# EAGLE design mosfet+buck_inverterV2 (EAGLE 9.3.0)
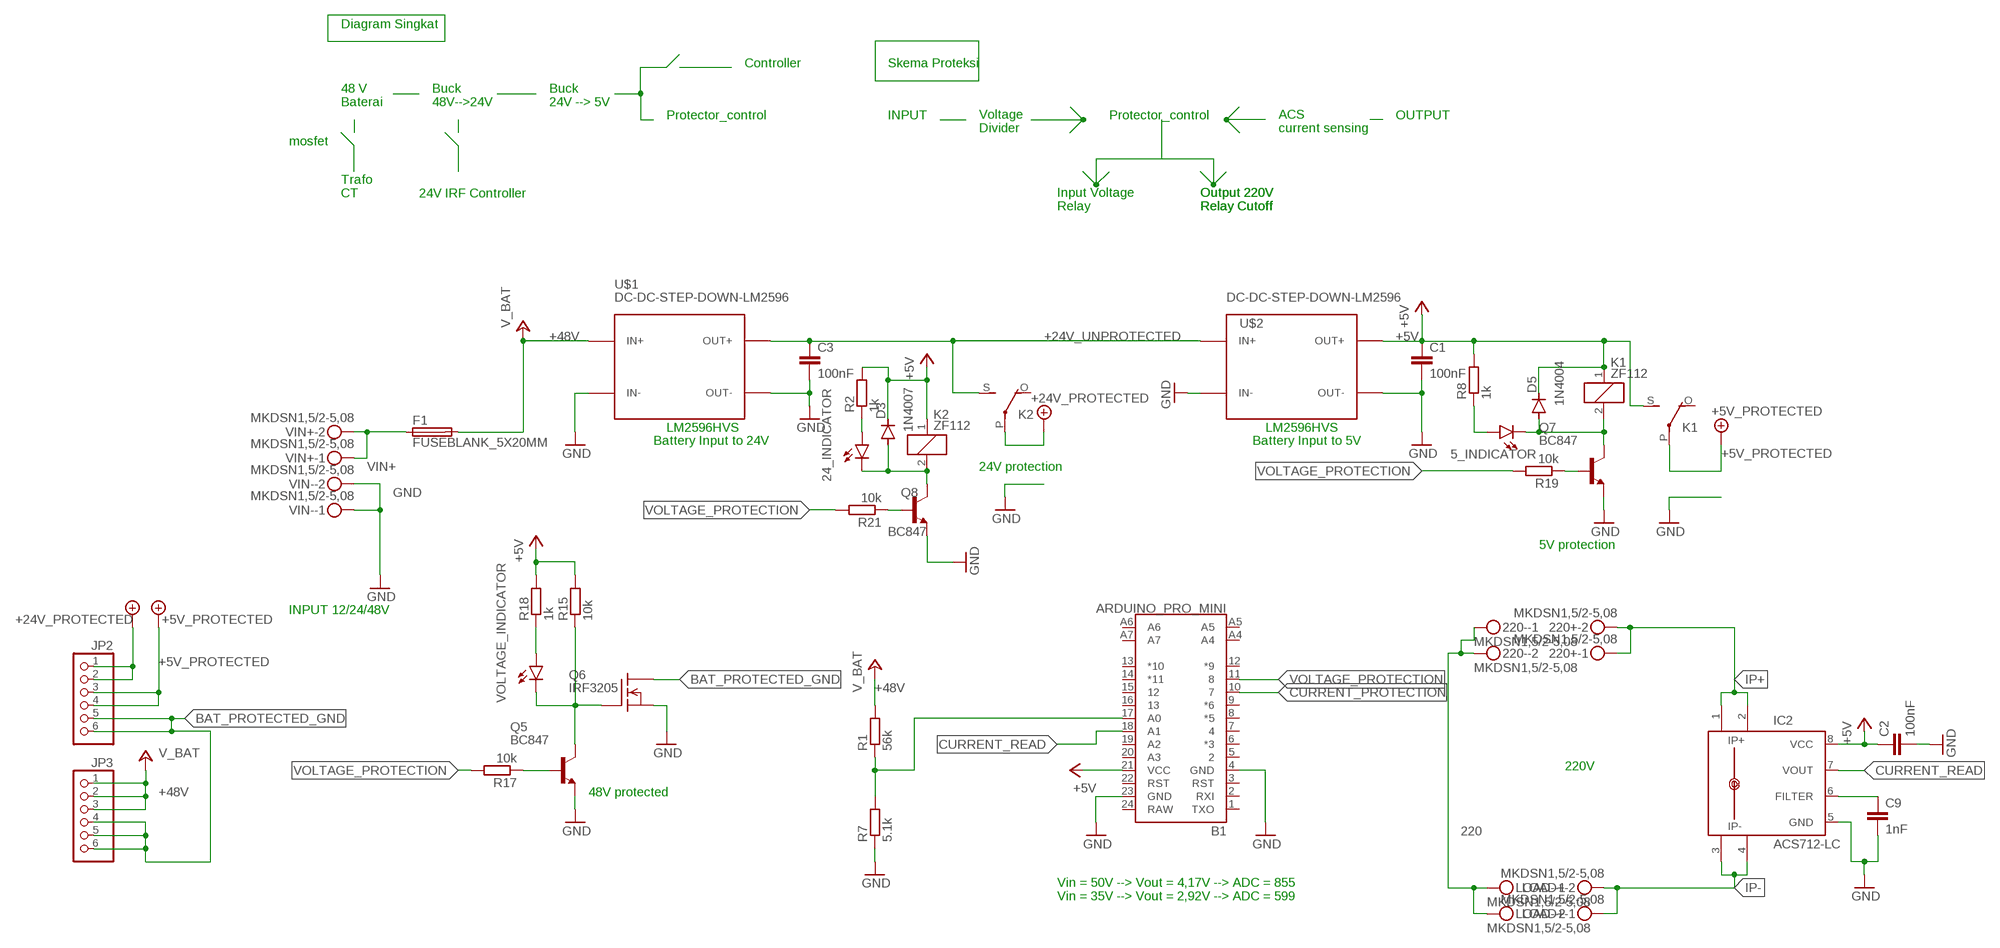
[diagram p0: schematic, sheet 1]

## Parts
5_INDICATOR  LED1206  [LED-1206]
24_INDICATOR  LED1206  [LED-1206]
220+  MKDSN1,5/2-5,08  [MKDSN1,5/2-5,08]
220-  MKDSN1,5/2-5,08  [MKDSN1,5/2-5,08]
B1  ARDUINO_PRO_MINI  [ARDUINO_PRO_MINI]
C1  100nF  C-EUC0805K  [C0805K]
C2  100nF  C-EUC0805K  [C0805K]
C3  100nF  C-EUC0805K  [C0805K]
C9  1nF  C-EUC0805K  [C0805K]
D3  1N4007  1N4004  [DO41-10]
D5  1N4004  [DO41-10]
F1  FUSEBLANK_5X20MM  [FUSE_HOLDER_5X20MM]
IC2  ACS712-LC  [SOIC8]
JP2  PINHD-1X6CLEAN  [1X06-CLEAN]
JP3  PINHD-1X6CLEAN  [1X06-CLEAN]
K1  ZF112  [ZF112]
K2  ZF112  [ZF112]
LOAD+  MKDSN1,5/2-5,08  [MKDSN1,5/2-5,08]
LOAD-  MKDSN1,5/2-5,08  [MKDSN1,5/2-5,08]
Q5  BC847  BC847ASMD  [SOT23]
Q6  IRF3205  IRF540  [TO220]
Q7  BC847  BC847ASMD  [SOT23]
Q8  BC847  BC847ASMD  [SOT23]
R1  56k  R-EU_R0805  [R0805]
R2  1k  R-EU_R0805  [R0805]
R7  5.1k  R-EU_R0805  [R0805]
R8  1k  R-EU_R0805  [R0805]
R15  10k  R-EU_R0805  [R0805]
R17  10k  R-EU_R0805  [R0805]
R18  1k  R-EU_R0805  [R0805]
R19  10k  R-EU_R0805  [R0805]
R21  10k  R-EU_R0805  [R0805]
U$1  DC-DC-STEP-DOWN-LM2596  [DC-DC-STEP-DOWN-LM2596]
U$2  DC-DC-STEP-DOWN-LM2596  [DC-DC-STEP-DOWN-LM2596]
VIN+  MKDSN1,5/2-5,08  [MKDSN1,5/2-5,08]
VIN-  MKDSN1,5/2-5,08  [MKDSN1,5/2-5,08]
VOLTAGE_INDICATOR  LED1206  [LED-1206]

## Nets
220: 220-.1 220-.2 LOAD-.1 LOAD-.2
+5V: B1.21(VCC) C1.1 C2.1 D3.C D5.C IC2.8(VCC) K1.1 K1.S(2:S) K2.1 R2.2 R8.2 R15.2 R18.2 U$2.OUT+
+5V_PROTECTED: JP2.3 JP2.4 K1.P(2:P)
+24V: JP2.1 JP2.2 K2.P(2:P) ; supply symbol labelled +24V_PROTECTED
+24V_UNPROTECTED: C3.1 K2.S(2:S) U$1.OUT+ U$2.IN+
+48V: F1.2 JP3.1 JP3.2 JP3.3 R1.2 U$1.IN+ ; supply symbol labelled V_BAT
BAT_PROTECTED_GND: JP2.5 JP2.6 JP3.4 JP3.5 JP3.6 Q6.2(D)
CURRENT_PROTECTION: B1.10
CURRENT_READ: B1.18(A1) IC2.7(VOUT)
GND: B1.4(GND) B1.23(GND) C1.2 C2.2 C3.2 C9.2 IC2.5(GND) Q5.2(E) Q6.3(S) Q7.2(E) Q8.2(E) R7.1 U$1.IN- U$1.OUT- U$2.IN- U$2.OUT- VIN-.1 VIN-.2
IP+: 220+.1 220+.2 IC2.1(IP+) IC2.2(IP+1)
IP-: IC2.3(IP-) IC2.4(IP-1) LOAD+.1 LOAD+.2
N$1: B1.17(A0) R1.1 R7.2
N$6: 24_INDICATOR.A R2.1
N$15: Q5.3(C) Q6.1(G) R15.1 VOLTAGE_INDICATOR.C
N$18: Q5.1(B) R17.1
N$21: 24_INDICATOR.C D3.A K2.2 Q8.3(C)
N$26: R18.1 VOLTAGE_INDICATOR.A
N$27: 5_INDICATOR.C D5.A K1.2 Q7.3(C)
N$28: Q7.1(B) R19.1
N$29: Q8.1(B) R21.1
N$30: C9.1 IC2.6(FILTER)
N$40: 5_INDICATOR.A R8.1
VIN+: F1.1 VIN+.1 VIN+.2
VOLTAGE_PROTECTION: B1.11 R17.2 R19.2 R21.2
Unconnected: B1.1(TXO) B1.2(RXI) B1.3(RST) B1.5 B1.6(*3) B1.7 B1.8(*5) B1.9(*6) B1.12(*9) B1.13(*10) B1.14(*11) B1.15 B1.16 B1.19(A2) B1.20(A3) B1.22(RST) B1.A4 B1.A5 B1.A6 B1.A7 K1.O(2:O) K2.O(2:O)

## Notes on the sheet
- Diagram Singkat
- Controller | Skema Proteksi
- 48 V
  Baterai
- Buck
  48V-->24V
- Buck
  24V --> 5V
- Protector_control | INPUT | Protector_control | OUTPUT
- Voltage 
  Divider
- ACS 
  current sensing
- mosfet
- Trafo
  CT
- 24V IRF Controller
- Input Voltage
  Relay
- Output 220V
  Relay Cutoff
- Output 220V
  Relay Cutoff
- LM2596HVS | LM2596HVS
- Battery Input to 24V | Battery Input to 5V
- 24V protection
- 5V protection
- INPUT 12/24/48V
- 220V
- 48V protected
- Vin = 50V --> Vout = 4,17V --> ADC = 855
  Vin = 35V --> Vout = 2,92V --> ADC = 599

## Power pins joined to a net without a drawn wire
RAW: B1.24(RAW)

## Library data of the parts
5_INDICATOR 24_INDICATOR VOLTAGE_INDICATOR = SparkFun-LED:LED: LED (Generic) Standard schematic elements and footprints for 5mm, 3mm, 1206, and 0603 sized LEDs. Generic LEDs with no color specified.
220+ 220- LOAD+ LOAD- VIN+ VIN- = con-phoenix-508:MKDSN1,5/2-5,08: MKDSN 1,5/ 2-5,08 Printklemme Nennstrom: 13,5 A Nennspannung: 250 V Rastermaß: 5,08 mm Polzahl: 2 Anschlussart: Schraubanschluss Montage: Löten Anschlussrichtung Leiter/Platine: 0 ° Artikelnummer: 1729128 Source: http://eshop.phoenixcontact.com .. 1729128.pdf
B1 = SparkFun-Boards:ARDUINO_PRO_MINI: SparkFun Pro Mini Pro Mini compatible footprint. Dimensions: 0.7 x 1.3" PCB Thickness: 0.8mm SparkFun Products: 3.3V/8MHz <https://www.sparkfun.com/products/11114> 5V/16MHz <https://www.sparkfun.com/products/11113>
C1-C3 C9 = rcl:C-EU: CAPACITOR, European symbol; SPICEPREFIX: C
D3 D5 = diode:1N4004: DIODE general purpose rectifier, 1 A
F1 = fuse:FUSE: Fuse; OC_FARNELL: unknown; OC_NEWARK: unknown
IC2 = allegro-2:ACS712-LC; SPICEPREFIX: X
JP2 JP3 = adafruit:PINHD-1X6: PIN HEADER
K1 K2 = relay:ZF112: RELAY 1 x switch; OC_FARNELL: unknown; OC_NEWARK: unknown
Q5 Q7 Q8 = transistor-npn:BC847*: NPN Transistor
Q6 = transistor-fet:IRF540: N-Channel Enhancement MOSFET (HEXFET); 100V; 28A; 0,077Ohm
R1 R2 R7 R8 R15 R17-R19 R21 = rcl:R-EU_: RESISTOR, European symbol; SPICEPREFIX: R
U$1 U$2 = diy-modules:DC-DC-STEP-DOWN-LM2596: DC/DC Step-Down Regulator based on LM2596-ADJ chip LM2596 datasheet available here: http://www.ti.com/lit/ds/symlink/lm2596.pdf Click here to find device on ebay.com <http://www.ebay.com/sch/lm2596+power+regulator>

## Board
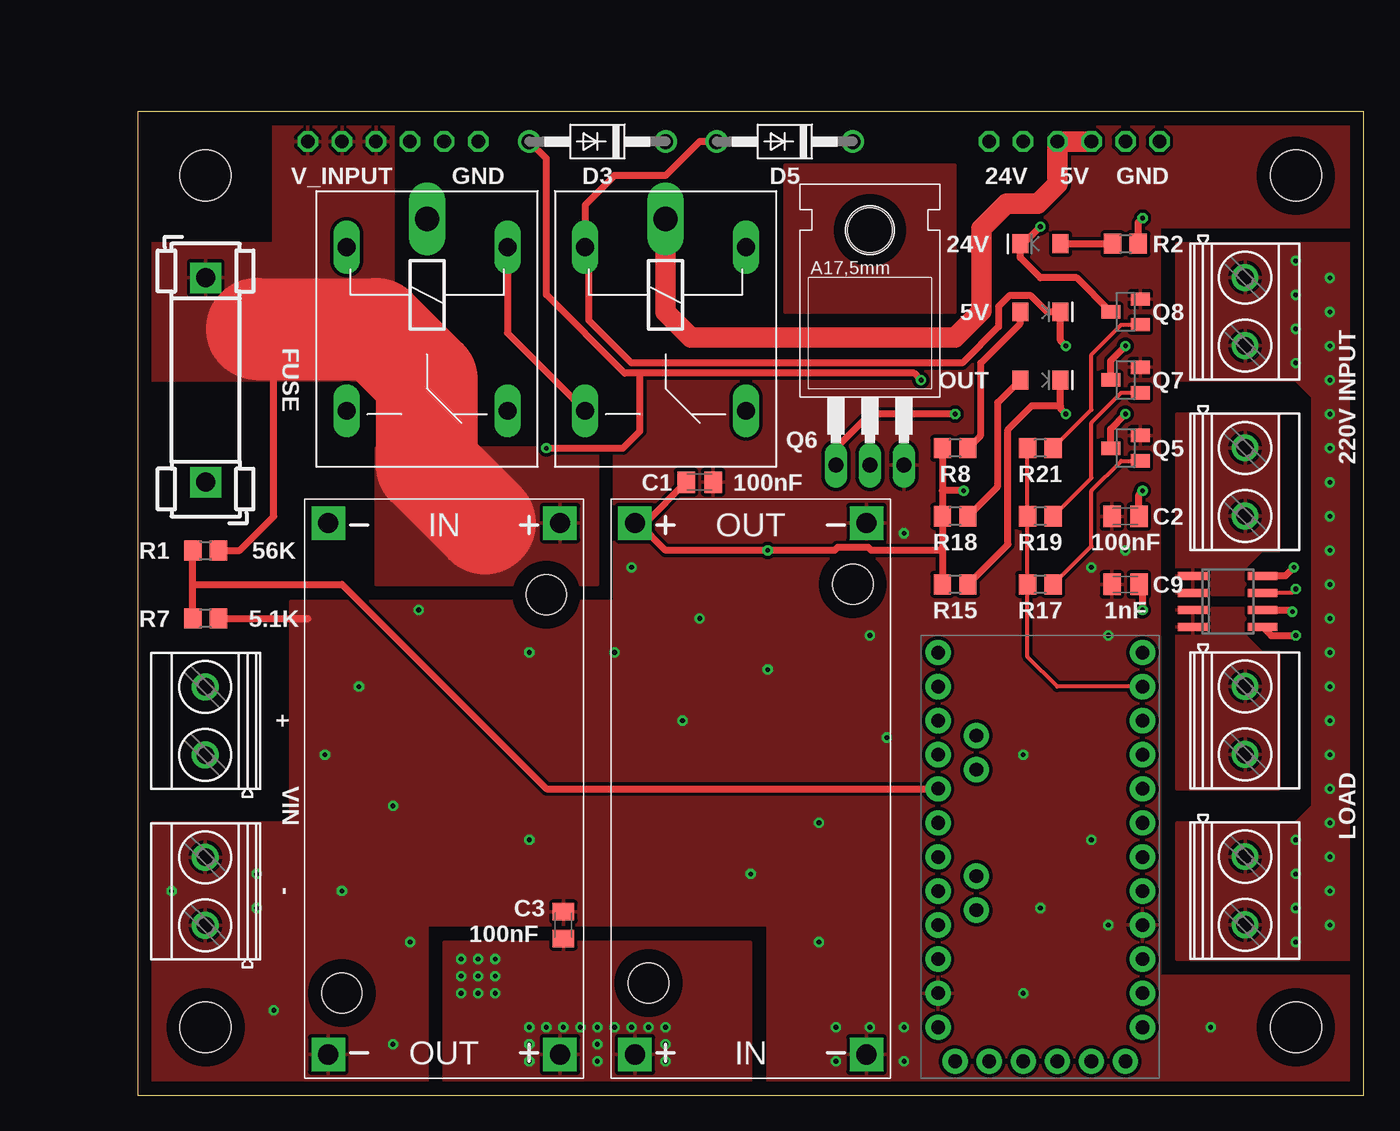
[diagram p1: board, top side]
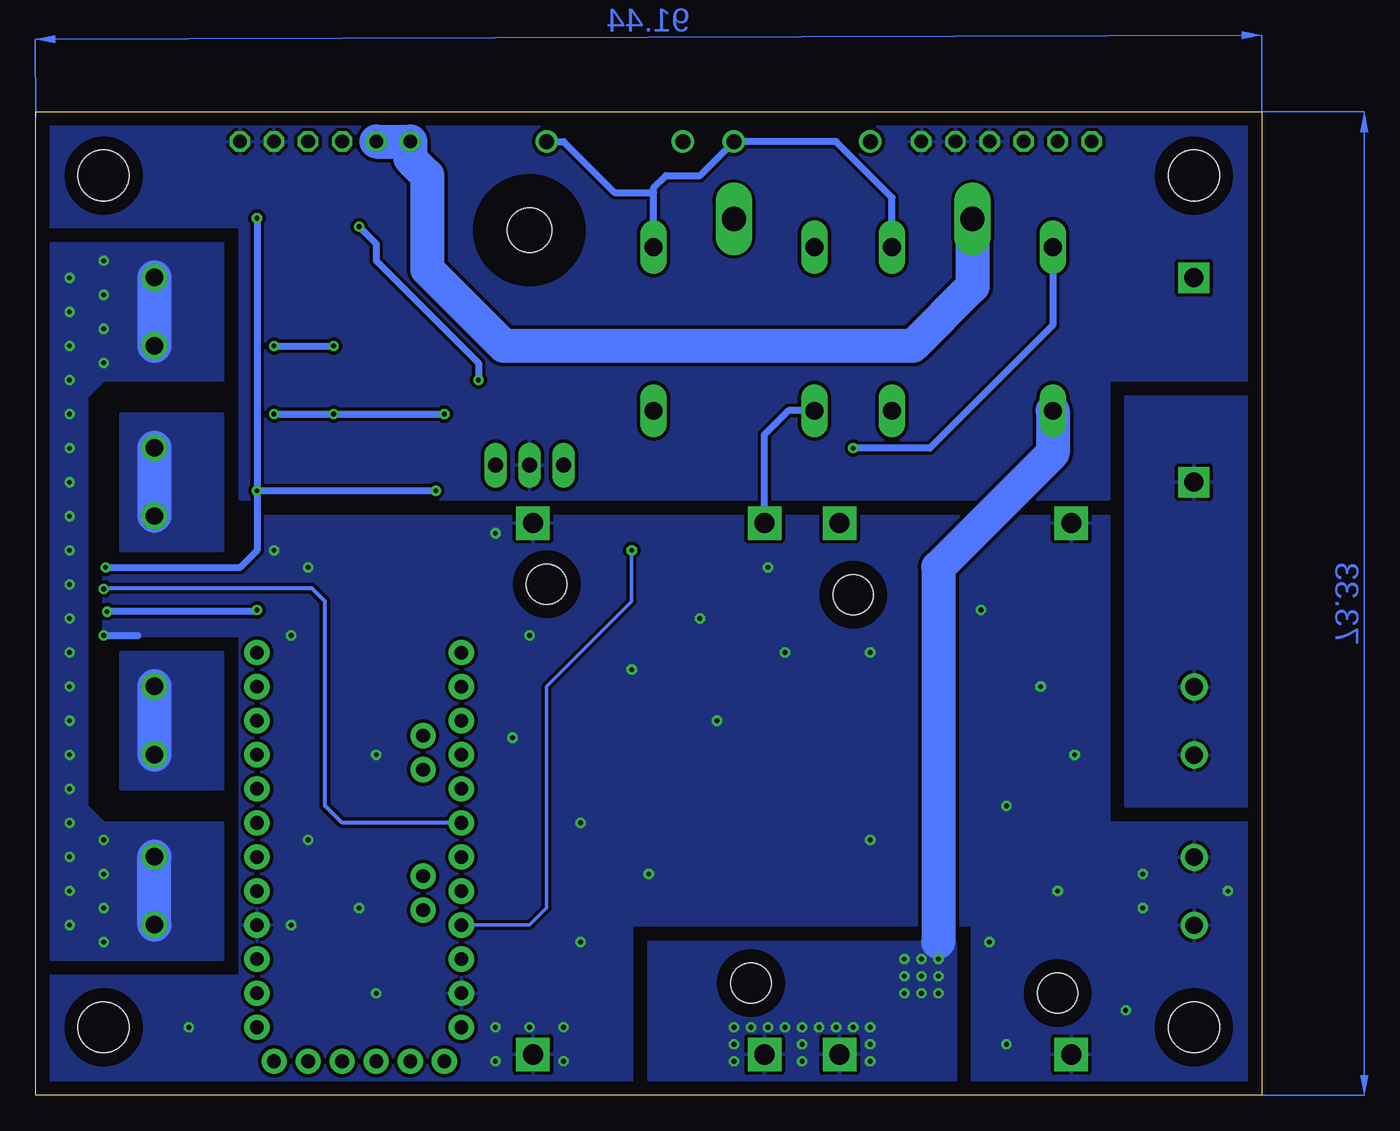
[diagram p2: board, bottom side, seen from below]

Size 91.42 x 73.33 mm. Coordinates in mm from the lower left corner, seen from the top.
Outline: 0,0 91.42,0 91.42,73.33 0,73.33 0,0
Copper layers (1*16): Top 0.035mm / dielectric 1.5mm / Bottom 0.035mm
Design rules "default *": minimum track width 6mil, minimum drill 0.35mm, track to track 10mil, track to pad 10mil, pad to pad 10mil, via to via 10mil, smd to smd 10mil, copper to edge 40mil, drill to drill 6mil, minimum pad ring 10mil, minimum via ring 8mil, stop-mask expansion 4mil, vias tented up to drill 15mil, thermal gap 10mil
Holes 3.81 mm at 5.08,5.08 5.08,68.58 86.36,5.08 86.36,68.58

### Footprints (pad centres in the part's own frame; a part is rotated, then mirrored left to right if it is on the bottom)
LED-1206 = smd 1.2 x 1.4: A -1.5,0; C 1.5,0
MKDSN1,5/2-5,08 = drill 1.3 pad 2: 1 -2.561,0.025; 2 2.519,0.025
ARDUINO_PRO_MINI = drill 1.016 pad 1.88: 1 -7.62,12.7; 2 -7.62,10.16; 3 -7.62,7.62; 4 -7.62,5.08; 5 -7.62,2.54; 6 -7.62,0; 7 -7.62,-2.54; 8 -7.62,-5.08; 9 -7.62,-7.62; 10 -7.62,-10.16; 11 -7.62,-12.7; 12 -7.62,-15.24; 13 7.62,-15.24; 14 7.62,-12.7; 15 7.62,-10.16; 16 7.62,-7.62; 17 7.62,-5.08; 18 7.62,-2.54; 19 7.62,0; 20 7.62,2.54; 21 7.62,5.08; 22 7.62,7.62; 23 7.62,10.16; 24 7.62,12.7; A4 4.763,1.429; A5 4.763,3.969; A6 4.763,-9.049; A7 4.763,-6.509; BLK -6.35,15.24; GND -3.81,15.24; GRN 6.35,15.24; RXI 1.27,15.24; TXO 3.81,15.24; VCC -1.27,15.24
C0805K = smd 1.3 x 1.6: 1 -1,0; 2 1,0
DO41-10 = drill 1.118: A 5.08,0; C -5.08,0
FUSE_HOLDER_5X20MM = drill 1.422 pad 2.286 square: 1 0,0; 2 15.24,0
SOIC8 = smd 0.6 x 2.2: 1 -1.905,-2.6; 2 -0.635,-2.6; 3 0.635,-2.6; 4 1.905,-2.6; 5 1.905,2.6; 6 0.635,2.6; 7 -0.635,2.6; 8 -1.905,2.6
1X06-CLEAN = drill 1.016 octagon: 1 -6.35,0; 2 -3.81,0; 3 -1.27,0; 4 1.27,0; 5 3.81,0; 6 6.35,0
ZF112 = drill 1.321 long: 1 -6.096,5.994; 2 -6.096,-5.994; O 6.096,5.994; S 6.096,-5.994 | drill 1.803 long: P -8.204,0
SOT23 = smd 1 x 1.4: 1 -0.95,-1.1; 2 0.95,-1.1; 3 0,1.1
TO220 = drill 1.118 long: 1 -2.54,-6.35; 2 0,-6.35; 3 2.54,-6.35 | hole 3.302: 0,11.176
R0805 = smd 1.3 x 1.5: 1 -0.95,0; 2 0.95,0
DC-DC-STEP-DOWN-LM2596 = drill 1.5 pad 2.5 square: IN+ -19.812,8.636; IN- -19.812,-8.636; OUT+ 19.812,8.636; OUT- 19.812,-8.636 | hole 3: -14.478,7.62; 15.24,-7.62

### Placement (x,y rotation side)
5_INDICATOR  67.31,58.42 0 top
24_INDICATOR  67.31,63.5 180 top
220+  82.55,45.72 270 top
220-  82.55,58.42 270 top
B1  67.31,17.78 180 top
C1  41.91,45.72 0 top
C2  73.66,43.18 180 top
C3  31.75,12.7 90 top
C9  73.66,38.1 180 top
D3  34.29,71.12 180 top
D5  48.26,71.12 180 top
F1  5.08,45.72 90 top
IC2  81.28,36.83 270 top
JP2  69.85,71.12 0 top
JP3  19.05,71.12 0 top
K1  39.37,57.15 270 top
K2  21.59,57.15 270 top
LOAD+  82.55,27.94 270 top
LOAD-  82.55,15.24 270 top
Q5  73.66,48.26 90 top
Q6  54.61,53.34 0 top
Q7  73.66,53.34 90 top
Q8  73.66,58.42 90 top
R1  5.08,40.64 0 top
R2  73.66,63.5 0 top
R7  5.08,35.56 180 top
R8  60.96,48.26 180 top
R15  60.96,38.1 180 top
R17  67.31,38.1 180 top
R18  60.96,43.18 180 top
R19  67.31,43.18 180 top
R21  67.31,48.26 180 top
U$1  22.86,22.86 270 top
U$2  45.72,22.86 90 top
VIN+  5.08,27.94 90 top
VIN-  5.08,15.24 90 top
VOLTAGE_INDICATOR  67.31,53.34 0 top

### Tracks (layer width: path | path; a pad name or v marks a point on that pad's centre or on a via)
220  (via drill 0.35)
  Bottom 2.54: 220-.1 220-.2 | LOAD-.2 LOAD-.1
  other vias: 88.9,22.86 88.9,25.4 88.9,27.94 88.9,30.48 88.9,33.02 88.9,35.56 88.9,38.1 88.9,40.64 88.9,43.18 88.9,45.72 88.9,48.26 88.9,50.8 88.9,53.34 88.9,20.32 88.9,17.78 88.9,15.24 88.9,12.7 86.36,11.43 86.36,13.97 86.36,16.51 86.36,19.05 88.9,55.88 88.9,58.42 88.9,60.96 86.36,62.23 86.36,59.69 86.36,57.15 86.36,54.61
  pour Bottom (no thermals): 77.47,63.5 91.44,63.5 91.44,10.16 77.47,10.16 77.47,20.32 86.36,20.32 87.63,21.59 87.63,52.07 86.36,53.34 77.47,53.34
  pour Top: 77.47,63.5 91.44,63.5 91.44,10.16 77.47,10.16 77.47,20.32 86.36,20.32 87.63,21.59 87.63,52.07 86.36,53.34 77.47,53.34
+5V  (via drill 0.35)
  Top 0.508: R8.2 60.01,45.09 | 60.01,45.09 R18.2 60.01,40.64 | 60.01,40.64 R15.2 | C1.1 37.86,42.67 U$2.OUT+ 37.34,42.67 39.37,40.64 v46.99,40.64 51.96,40.64 52.19,40.87 54.49,40.87 54.72,40.64 60.01,40.64 | 83.19,38.73 IC2.8 85.58,38.73 v86.22,39.37 | K2.1 27.58,56.84 K1.S | C2.1 74.66,44.81 v74.93,45.09 | v61.59,45.09 60.01,45.09 | R2.2 74.61,65.08 v74.93,65.41
  Bottom 0.254: v46.99,40.64 46.99,36.83 53.34,30.48 53.34,13.97 54.61,12.7 B1.21
  Bottom 0.508: K2.1 27.58,66.95 31.75,71.12 D3.C 41.91,68.58 44.45,68.58 45.36,67.67 45.36,67.31 | K1.1 45.36,67.31 | D5.C 52.07,71.12 48.26,67.31 45.36,67.31 | U$2.OUT+ 37.08,49.28 35.31,51.05 K1.S | v74.93,45.09 v61.59,45.09 | v74.93,45.09 74.93,40.64 76.2,39.37 v86.22,39.37 | v74.93,65.41 v74.93,45.09
+5V_PROTECTED
  Top 1.524: K1.P 39.37,58.42 41.27,56.52 60.96,56.52 62.92,58.48 62.92,64.62 64.79,66.49 67.12,66.49 68.58,67.94 JP2.3 JP2.4
+24V
  Bottom 2.54: K2.P 21.59,60.33 26.04,55.88 56.52,55.88 62.23,61.59 62.23,68.58 63.5,69.85 JP2.1 JP2.2
+24V_UNPROTECTED  (via drill 0.35)
  Bottom 2.54: 24.13,11.43 24.13,39.37 15.6,47.9 K2.S
  other vias: 29.21,5.08 30.48,5.08 31.75,5.08 33.02,5.08 34.29,5.08 34.29,3.81 34.29,2.54 29.21,2.54 29.21,3.81 35.56,5.08 36.83,5.08 38.1,5.08 39.37,5.08 39.37,3.81 39.37,2.54 24.13,10.16 24.13,8.89 24.13,7.62 25.4,7.62 25.4,8.89 25.4,10.16 26.67,10.16 26.67,8.89 26.67,7.62
  pour Top: 22.86,0 22.86,11.43 44.45,11.43 45.72,11.43 45.72,0
  pour Bottom: 22.86,0 22.86,11.43 45.72,11.43 45.72,0
+48V
  Top 0.508: R1.2 7.62,40.64 10.16,43.18 10.16,55.88 8.89,57.15
  Top 7.62: 8.89,57.15 17.78,57.15 21.59,53.34 21.59,46.99 25.91,42.67
  pour Top: 0,63.5 10.16,63.5 10.16,73.66 19.05,73.66 19.05,53.34 0,53.34
  pour Top: 17.78,48.26 34.29,48.26 34.29,38.1 17.78,38.1
BAT_PROTECTED_GND
  pour Bottom: 0,73.66 91.44,73.66 91.44,64.77 76.2,64.77 76.2,44.45 11.43,44.45 11.43,53.34 0,53.34
CURRENT_READ  (via drill 0.35)
  Top 0.305: v86.36,37.76 86.06,37.47 IC2.7
  Bottom 0.305: v86.36,37.76 86.3,37.82 70.84,37.82 69.85,36.83 69.85,21.59 68.58,20.32 B1.18
GND  (via drill 0.35)
  Top 0.508: v86.36,34.29 84.52,34.29 IC2.5 84.45,34.92 | R7.1 12.7,35.56
  Bottom 0.508: v86.36,34.29 83.82,34.29
  other vias: 73.66,40.64 71.12,39.37 72.39,34.29 71.12,19.05 66.04,25.4 67.31,13.97 72.39,12.7 80.01,5.08 66.04,7.62 52.07,5.08 54.61,5.08 57.15,5.08 57.15,2.54 52.07,2.54 50.8,11.43 45.72,16.51 50.8,20.32 55.88,26.67 54.61,34.29 46.99,31.75 40.64,27.94 41.91,35.56 35.56,33.02 36.83,39.37 57.15,41.91 29.21,33.02 16.51,30.48 13.97,25.4 19.05,21.59 15.24,15.24 20.32,11.43 19.05,3.81 10.16,6.35 8.89,16.51 8.89,13.97 2.54,15.24 29.21,19.05 20.95,36.2
  pour Top: 11.43,36.83 35.56,36.83 35.56,73.66 46.99,73.66 46.99,57.15 62.23,57.15 62.23,73.66 91.44,73.66 91.44,64.77 76.2,64.77 76.2,8.89 91.44,8.89 91.44,0 46.99,0 46.99,12.7 21.59,12.7 21.59,0 0,0 0,20.32 11.43,20.32
  pour Bottom: 11.43,43.18 11.43,20.32 0,20.32 0,0 21.59,0 21.59,12.7 46.99,12.7 46.99,0 91.44,0 91.44,8.89 76.2,8.89 76.2,34.29 86.36,34.29 86.36,39.37 76.2,39.37 76.2,43.18
IP+
  Bottom 2.54: 220+.1 220+.2
  pour Top: 77.47,37.34 82.55,37.34 82.55,39.37 83.82,40.64 85.09,40.64 85.09,50.8 77.47,50.8
  pour Bottom: 77.47,50.8 85.09,50.8 85.09,40.64 83.82,40.64 77.47,40.64
IP-
  Bottom 2.54: LOAD+.1 LOAD+.2
  pour Top: 77.47,36.32 82.55,36.32 82.55,34.29 83.82,33.02 85.09,33.02 85.09,22.86 77.47,22.86
  pour Bottom: 77.47,22.86 85.09,22.86 85.09,33.02 77.47,33.02
N$1
  Top 0.508: R7.2 4.13,38.1 | 4.13,38.1 R1.1 | 4.13,38.1 15.24,38.1 30.48,22.86 B1.17
N$6
  Top 0.254: 72.39,63.5 R2.1
  Top 0.508: 24_INDICATOR.A 72.39,63.5
N$15  (via drill 0.35)
  Top 0.508: Q5.3 72.56,49.7 v73.66,50.8 | v69.22,50.8 68.81,51.2 68.81,51.44 | 68.81,51.44 VOLTAGE_INDICATOR.C | R15.1 64.9,41.09 64.9,49.66 66.67,51.44 68.81,51.44 | v60.96,50.8 54.61,50.8 52.07,48.26 Q6.1
  Bottom 0.508: v73.66,50.8 v69.22,50.8 v60.96,50.8
N$18
  Top 0.305: R17.1 71.12,40.96 71.12,45.09 73.34,47.31 Q5.1
N$21  (via drill 0.35)
  Top 0.508: Q8.3 70.02,60.96 67.31,60.96 65.81,62.46 24_INDICATOR.C 66.04,63.5 v67.31,64.77 | v58.42,53.34 57.91,53.85 37.47,53.85 | 37.47,53.85 36.32,53.85 30.48,59.69 30.48,69.85 D3.A | v30.48,48.26 36.2,48.26 37.47,49.53 37.47,53.85
  Bottom 0.508: v67.31,64.77 66.04,63.5 66.04,62.23 58.42,54.61 v58.42,53.34 | K2.2 15.6,57.43 24.77,48.26 v30.48,48.26
N$26
  Top 0.508: R18.1 64.14,45.41 64.14,51.66 VOLTAGE_INDICATOR.A
N$27  (via drill 0.35)
  Top 0.508: D5.A 41.91,71.12 39.37,68.58 35.56,68.58 33.38,66.4 K1.2 33.66,62.97 33.66,57.78 36.83,54.61 61.49,54.61 64.19,57.32 64.19,58.82 65,59.63 66.62,59.63 67.83,58.42 5_INDICATOR.C 68.81,56.28 v69.22,55.88 | Q7.3 72.56,54.78 v73.66,55.88
  Bottom 0.508: v73.66,55.88 v69.22,55.88
N$28
  Top 0.305: R19.1 71.12,46.04 71.12,50.16 73.34,52.39 Q7.1
N$29
  Top 0.305: R21.1 71.12,51.12 71.12,55.24 73.34,57.47 Q8.1
N$30  (via drill 0.35)
  Top 0.508: C9.1 74.93,37.83 v74.93,36.2 | IC2.6 86.11,36.2 v86.11,36.07
  Bottom 0.508: v74.93,36.2 75.06,36.07 v86.11,36.07
N$40
  Top 0.508: R8.1 62.87,49.22 62.87,54.61 65.81,57.55 5_INDICATOR.A
NNNN
  pour Top: 48.26,69.34 60.96,69.34 60.96,58.42 48.26,58.42
VIN+
  pour Bottom: 0,52.07 10.16,52.07 10.16,21.59 0,21.59
VOLTAGE_PROTECTION
  Top 0.305: R21.2 R19.2 R17.2 66.36,32.7 68.58,30.48 B1.11
  Top 0.508: R17.2 66.04,38.1 66.36,38.42
(copper drawn outside any net)
  shapes: Bottom area x2

### Text on the board
tPlace: V_INPUT | GND | D3 | D5 | 24V | 5V | GND | 24V | R2 | 5V | Q8 | FUSE | OUT | Q7 | 220V INPUT | Q6 | Q5 | C1 | 100nF | R8 | R21 | C2 | R1 | 56K | R18 | R19 | 100nF | C9 | R7 | 5.1K | R15 | R17 | 1nF | + | VIN | LOAD | - | C3 | 100nF